# Altium project PCB_Project.PrjPcb
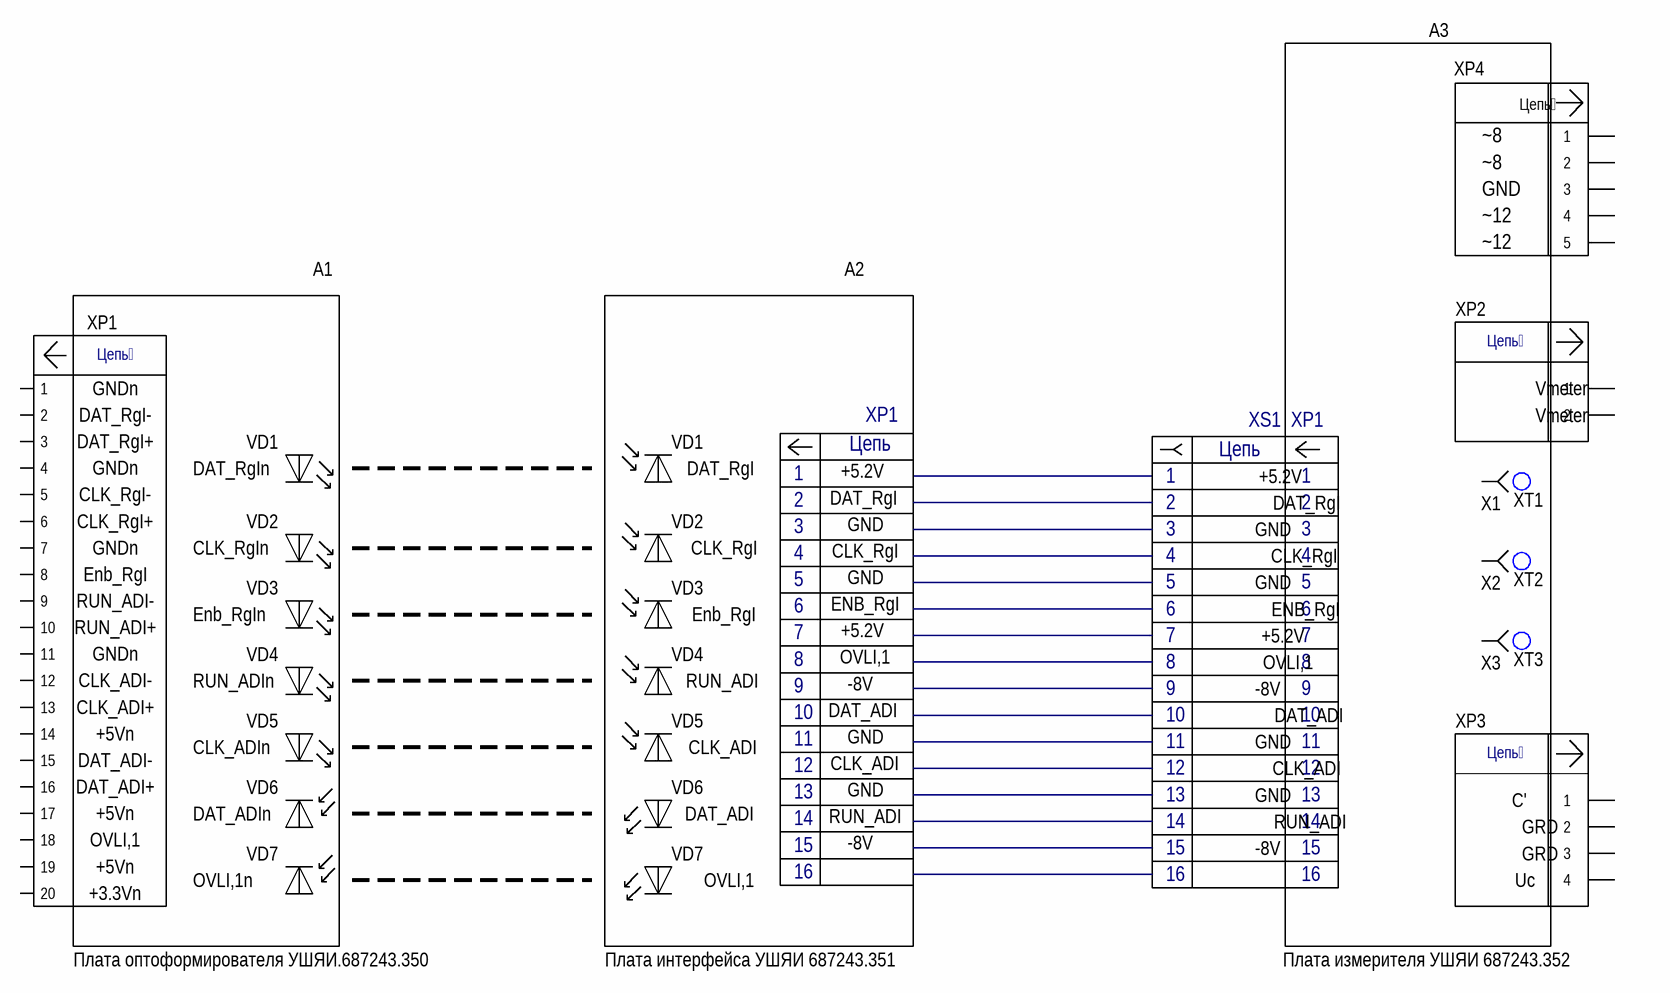
[diagram p0: Sheet1.SchDoc]
1 sheet, 24 parts. Net scope: global (net labels, ports and power ports of the same name join across sheets).

## Sheet Sheet1.SchDoc
size 420 x 297 mm; SheetTotal: 1

### Parts
(Parts that share a designator on the sheet are numbered #1, #2 ... from top to bottom, then left to right.)
VD1#1  VSMY2853RG  [VSMY2853G]  (value not drawn)
VD1#2  SFH203  [SFH203]  (value not drawn)
VD2#1  VSMY2853RG  [VSMY2853G]  (value not drawn)
VD2#2  SFH203  [SFH203]  (value not drawn)
VD3#1  VSMY2853RG  [VSMY2853G]  (value not drawn)
VD3#2  SFH203  [SFH203]  (value not drawn)
VD4#1  VSMY2853RG  [VSMY2853G]  (value not drawn)
VD4#2  SFH203  [SFH203]  (value not drawn)
VD5#1  VSMY2853RG  [VSMY2853G]  (value not drawn)
VD5#2  SFH203  [SFH203]  (value not drawn)
VD6#1  VSMY2853RG  [VSMY2853G]  (value not drawn)
VD6#2  SFH203  [SFH203]  (value not drawn)
VD7#1  VSMY2853RG  [VSMY2853G]  (value not drawn)
VD7#2  SFH203  [SFH203]  (value not drawn)
X1  TR-1,25-4  (value not drawn)
X2  TR-1,25-4  (value not drawn)
X3  TR-1,25-4  (value not drawn)
XP1  BH2-20  [DS1014-20S]  (value not drawn)
XP2  280370-2  [280370-2]  (value not drawn)
XP3  280371-2  [280371-2]  (value not drawn)
XP4  DS1074-5MVT6  [DS1074-5MV]  (value not drawn)
XT1  УШЯИ.685631.123  (value not drawn)
XT2  УШЯИ.685631.123  (value not drawn)
XT3  УШЯИ.685631.123  (value not drawn)

### Nets

Not connected (* = marked no-connect by the designer): VD1#1 1(Anode) 2(Cathode); VD1#2 1 2; VD2#1 1(Anode) 2(Cathode); VD2#2 1 2; VD3#1 1(Anode) 2(Cathode); VD3#2 1 2; VD4#1 1(Anode) 2(Cathode); VD4#2 1 2; VD5#1 1(Anode) 2(Cathode); VD5#2 1 2; VD6#1 1(Anode) 2(Cathode); VD6#2 1 2; VD7#1 1(Anode) 2(Cathode); VD7#2 1 2; X1 1; X2 1; X3 1; XP1 1 2 3 4 5 6 7 8 9 10 11 12 13 14 15 16 17 18 19 20; XP2 1 2; XP3 1 2 3 4; XP4 1 2 3 4 5

### Notes on the sheet
- A3
- ~8
- GND
- ~12
- A1
- A2
- GNDn
- (near XP1) DAT_RgI-
- (near XP1) DAT_RgI+
- Цепь
- XP1
- XS1
- Vmeter
- (near XP1) CLK_RgI-
- (near XP1) CLK_RgI+
- (near VD1#1) DAT_RgIn
- (near VD1#2) DAT_RgI
- 1
- DAT_RgI
- +5.2V
- (near XP1) Enb_RgI
- (near VD2#1) CLK_RgIn
- CLK_RgI
- 3
- 4
- 5
- (near XP1) RUN_ADI-
- (near XP1) RUN_ADI+
- (near VD3#1) Enb_RgIn
- Enb_RgI
- 6
- 7
- ENB_RgI
- (near XP1) CLK_ADI-
- (near XP1) CLK_ADI+
- (near VD4#1) RUN_ADIn
- (near VD4#2) RUN_ADI
- 8
- 9
- 10
- DAT_ADI
- OVLI,1
- -8V
- (near XP1) DAT_ADI+
- +5Vn
- (near XP1) DAT_ADI-
- (near VD5#1) CLK_ADIn
- (near VD5#2) CLK_ADI
- 11
- 12
- CLK_ADI
- (near XP1) OVLI,1
- (near VD6#2) DAT_ADIn
- (near VD6#1) DAT_ADI
- 13
- 14
- 15
- RUN_ADI
- C'
- GRD
- (near XP1) +3.3Vn
- OVLI,1n
- 16
- Uc
- Плата оптоформирователя УШЯИ.687243.350
- Плата интерфейса УШЯИ 687243.351
- Плата измерителя УШЯИ 687243.352
- Перв. примен.
- Справ. №
- Подп. дата
- Инв. № дубл.
- Взам. инв. №
- Подп. и дата
- Изм.
- Разраб.
- Лист
- № докум.
- Подп.
- Дата
- Лит.
- Масса
- Масштаб
- Пров.
- Т.контр.
- Листов
- Инв. № подл.
- Н.контр.
- Утв.
- ALTIUM GOSTBOM2.0 KEV
- Файл:
- Копировал
- Формат А3
- (in symbol 280370-2) Цепь
- (in symbol 280371-2) Цепь
- (in symbol BH2-20) Цепь
- (in symbol DS1074-5MVT6) Цепь

### Library data of the parts
VD1#1 VD2#1 VD3#1 VD4#1 VD5#1 VD6#1 VD7#1 = VSMY2853RG: High Speed Infrared Emitting Diodes, 850 nm, / Surface Emitter Technology
VD1#2 VD2#2 VD3#2 VD4#2 VD5#2 VD6#2 VD7#2 = SFH203: Silicon PIN Photodiode
X1-X3 = TR-1,25-4: Клемма TR-1,25-4
XP1 = BH2-20: pitch 2mm, 20 pin 2x10; System: Connector
XP2 = 280370-2: Connector
XP3 = 280371-2: Connector